# Altium schematic sheet [XX] - DOC REVISION HISTORY.SchDoc: Revision History
size A4; DocumentNumber: 3; SheetNumber: 3; SheetTotal: 4
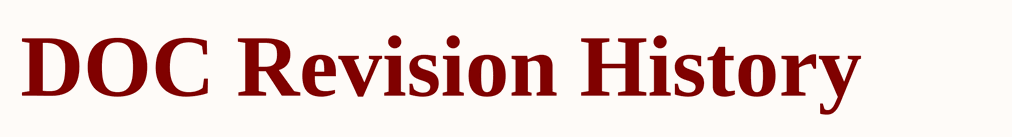
[diagram p0: [XX] - DOC REVISION HISTORY.SchDoc]

## Notes on the sheet
- DOC Revision History
- Title
- Size:
- Date:
- A4
- Number:
- Time:
- Revision:
- Sheet
- of
- File: